# Altium project AE170_PDU_02.04.PrjPcb
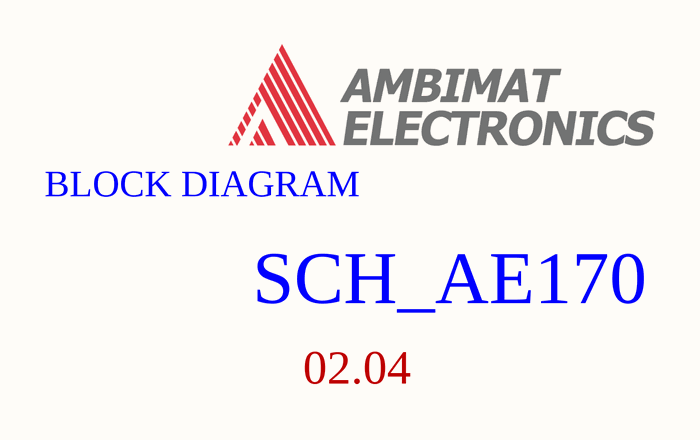
[diagram p0: 1. BD.SchDoc]
6 sheets, 141 parts. Net scope: global (net labels, ports and power ports of the same name join across sheets).
Board file: AE170_PDU_02.04.PcbDoc
Sheets:
  1. BD.SchDoc
  2. Input Section.SchDoc
  3. Buck Boost_19V.SchDoc
  4. Buck Boost_12V.SchDoc
  5. Buck_5V1A.SchDoc
  6. Revision History.SchDoc

## Sheet 1. BD.SchDoc
size A4; SheetNumber: 1; SheetTotal: 6

### Notes on the sheet
- BLOCK DIAGRAM
- SCH_AE170
- 02.04
- TITLE:
- Design By:
- NOTE: THIS DRAWING AND CONTENTS ARE CONFIDENTIAL AND ARE NOT TO BE COPIED
- Document Number:
- Rev:
- Sheet:
- of

## Sheet 2. Input Section.SchDoc
size A4; SheetNumber: 2; SheetTotal: 6; PageSetup: Record=PageOptions|CenterHorizontal=True|CenterVertical=True|PrintScale=1.00|XCorrection=1.00|YCorrection=1.00|PrintKind=0|BorderSize=5000000|LeftOffset=0|BottomOffset=0|Orientation=2|PaperLength=1000|PaperWidth=1000|Scale=100|PaperSource=7|PrintQuality=-3|MediaType=1|DitherType=10|PrintScaleMode=1|PaperKind=A4|PaperIndex=9
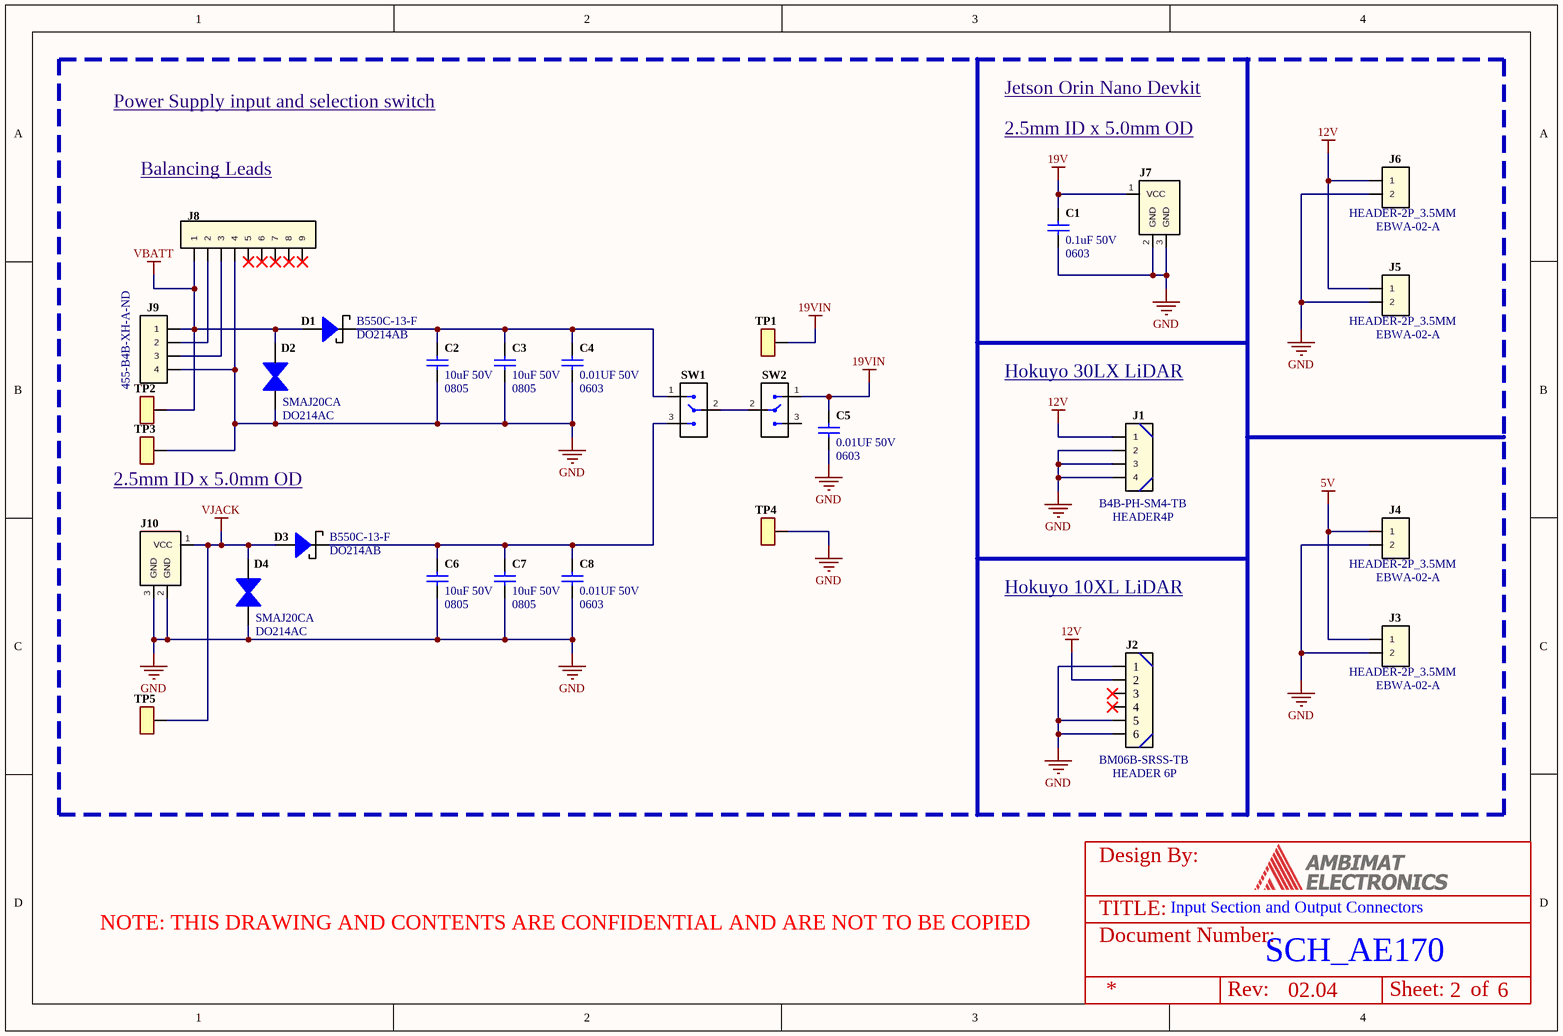
[diagram p1: 2. Input Section.SchDoc]

### Parts
C1  Part Name: 0.1uF 50V  PCB Footprint: 0603  [0603C]  (hidden comment: CAP CER 0.1UF 50V X7R 0603)
C2  Part Name: 10uF 50V  PCB Footprint: 0805  [0805C]  (hidden comment: CAP CER 10UF 50V X5R 0805)
C3  Part Name: 10uF 50V  PCB Footprint: 0805  [0805C]  (hidden comment: CAP CER 10UF 50V X5R 0805)
C4  Part Name: 0.01UF 50V  PCB Footprint: 0603  [0603C]  (hidden comment: CAP CER 10000PF 50V X7R 0603)
C5  Part Name: 0.01UF 50V  PCB Footprint: 0603  [0603C]  (hidden comment: CAP CER 10000PF 50V X7R 0603)
C6  Part Name: 10uF 50V  PCB Footprint: 0805  [0805C]  (hidden comment: CAP CER 10UF 50V X5R 0805)
C7  Part Name: 10uF 50V  PCB Footprint: 0805  [0805C]  (hidden comment: CAP CER 10UF 50V X5R 0805)
C8  Part Name: 0.01UF 50V  PCB Footprint: 0603  [0603C]  (hidden comment: CAP CER 10000PF 50V X7R 0603)
D1  PCB Footprint: DO214AB  Part Name: B550C-13-F  [DO-214AB-SHKY]  (hidden comment: DIODE SCHOTTKY 50V 5A SMC)
D2  PCB Footprint: DO214AC  Part Name: SMAJ20CA  [DO-214AC]  (hidden comment: TVS DIODE 20VWM 32.4VC DO214AC)
D3  PCB Footprint: DO214AB  Part Name: B550C-13-F  [DO-214AB-SHKY]  (hidden comment: DIODE SCHOTTKY 50V 5A SMC)
D4  PCB Footprint: DO214AC  Part Name: SMAJ20CA  [DO-214AC]  (hidden comment: TVS DIODE 20VWM 32.4VC DO214AC)
J1  Manu Part Number: B4B-PH-SM4-TB  Part Name: HEADER4P  [JST_B4B-PH-SM4-TB]  (hidden comment: CONN HEADER SMD 4POS 2MM)
J2  Manu Part Number: BM06B-SRSS-TB  PCB Footprint: HEADER 6P  [BM06B-SRSS-TB_JST]  (hidden comment: CONN HEADER SMD 6POS 1MM)
J3  Manu Part Number: EBWA-02-A  PCB Footprint: HEADER-2P_3.5MM  [Header3.5]  (hidden comment: EURO BLOCK 2P)
J4  Manu Part Number: EBWA-02-A  PCB Footprint: HEADER-2P_3.5MM  [Header3.5]  (hidden comment: EURO BLOCK 2P)
J5  Manu Part Number: EBWA-02-A  PCB Footprint: HEADER-2P_3.5MM  [Header3.5]  (hidden comment: EURO BLOCK 2P)
J6  Manu Part Number: EBWA-02-A  PCB Footprint: HEADER-2P_3.5MM  [Header3.5]  (hidden comment: EURO BLOCK 2P)
J7  CONN PWR JACK 2.5X5.5MM SOLDER  [PJ-050BH]  (value not drawn)
J8  HEADER 1x9  [HEADER-9P_2.54MM]  (value not drawn)
J9  Vendor-1 Part Number: 455-B4B-XH-A-ND  [JST_B4B-XH-A]  (hidden comment: CONN HEADER VERT 4POS 2.5MM)
J10  CONN PWR JACK 2.5X5.5MM SOLDER  [PJ-050BH]  (value not drawn)
SW1  SWITCH TOGGLE SPDT 7.5A 125V  [E101SYZQE]  (value not drawn)
SW2  SWITCH TOGGLE SPDT 7.5A 125V  [E101SYZQE]  (value not drawn)
TP1  TEST POINT  [TP-1.5mmSMD]  (value not drawn)
TP2  TEST POINT  [TP-1.5mmSMD]  (value not drawn)
TP3  TEST POINT  [TP-1.5mmSMD]  (value not drawn)
TP4  TEST POINT  [TP-1.5mmSMD]  (value not drawn)
TP5  TEST POINT  [TP-1.5mmSMD]  (value not drawn)

### Nets
5V: J3.1 J4.1
12V: J1.1 J2.2 J5.1 J6.1
19V: C1.2 J7.1(VCC)
19VIN: C5.1 SW2.1 TP1.1
GND: C1.1 C2.2 C3.2 C4.2 C5.2 C6.2 C7.2 C8.2 D2.1(A) D4.1(A) J1.2 J1.3 J1.4 J2.1 J2.5 J2.6 J3.2 J4.2 J5.2 J6.2 J7.2(GND) J7.3(GND) J8.4 J9.4 J10.2(GND) J10.3(GND) TP3.1 TP4.1
VBATT: D1.2 D2.2(K) J8.1 J9.1 TP2.1
VJACK: D3.2 D4.2(K) J10.1(VCC) TP5.1
NetC2_1: C2.1 C3.1 C4.1 D1.1 SW1.1
NetC6_1: C6.1 C7.1 C8.1 D3.1 SW1.3
NetJ8_2: J8.2 J9.2
NetJ8_3: J8.3 J9.3
NetSW1_2: SW1.2 SW2.2

Not connected (* = marked no-connect by the designer): J2 3* 4*; J8 5* 6* 7* 8* 9*; SW2 3

### Notes on the sheet
- Power Supply input and selection switch
- Jetson Orin Nano Devkit
- Balancing Leads
- 2.5mm ID x 5.0mm OD
- Hokuyo 30LX LiDAR
- (near TP3) 2.5mm ID x 5.0mm OD
- Hokuyo 10XL LiDAR
- Input Section and Output Connectors
- SCH_AE170
- 02.04
- TITLE:
- Design By:
- NOTE: THIS DRAWING AND CONTENTS ARE CONFIDENTIAL AND ARE NOT TO BE COPIED
- Document Number:
- Rev:
- Sheet:
- of

### Library data of the parts
C1 = CS0.1uF-50V0603: Manu Part Number: CC0603KRX7R9BB104; Manufacturer: Yageo; Vendor-1 Part Number: 311-1344-1-ND; Type: SMD; Vendor-1: DIGIKEY; Vendor-2: MOUSER; Lead Free: YES; Mounting: YES; RoHS Compliant: YES
C2 C3 C6 C7 = CS10uF-50V0805: Manu Part Number: GRM21BR61H106KE43L; Manufacturer: Murata Electronics; Vendor-1 Part Number: 490-18663-1-ND; Type: SMD; Vendor-1: DIGIKEY; Vendor-2: FARNELL; Help URL: *; Lead Free: YES; Mounting: YES; RoHS Compliant: YES
C4 C5 C8 = CS0.01uF-50V0603: Manu Part Number: CC0603KPX7R9BB103; Manufacturer: Yageo; Vendor-1 Part Number: 311-1572-1-ND; Type: SMD; Vendor-1: DIGIKEY; Vendor-2: FARNELL; Lead Free: YES; Mounting: YES; RoHS Compliant: YES
D1 D3 = DS-B550C-13-F: Manufacturer: Diodes Incorporated; Vendor-1 Part Number: B550C-FDICT-ND; Type: SMD; Vendor-1: DIGI-KEY; Vendor-2: MOUSER; Help URL: *; Lead Free: YES; Mounting: YES; Manu Part Number: B550C-13-F
D2 D4 = DS-SMAJ20CA: Manufacturer: Littelfuse Inc.; Vendor-1 Part Number: SMAJ20CALFCT-ND; Type: SMD; Vendor-1: DIGI-KEY; Vendor-2: MOUSER; Help URL: *; Lead Free: YES; Mounting: YES; Manu Part Number: SMAJ20CA
J1 = CON2.0P-4x1SMT: Manufacturer: JST Sales America Inc.; Vendor-1 Part Number: 455-B4B-PH-SM4-TBCT-ND; PCB Footprint: HEADER-4P_2.0MM; Vendor-1: DIGIKEY; Vendor-2: FARNELL; Mounting: YES; RoHS Compliant: YES; Type: SMT; Lead Free: YES
J2 = CON1.0P-6x1 SMT: Manufacturer: JST Sales America Inc.; Vendor-1 Part Number: 455-BM06B-SRSS-TBCT-ND; Vendor-1: DIGIKEY; Vendor-2: FARNELL; Mounting: YES; Part Name: BM06B-SRSS-TB; RoHS Compliant: YES; Type: SMD; Lead Free: YES
J3-J6 = CON3.5P-2x1TH_STRT: Manufacturer: Adam Tech; Part Name: HEADER2P; Vendor-1 Part Number: 2057-EBWA-02-A-ND; Vendor-1: DIGIKEY; Vendor-2: FARNELL; Mounting: YES; RoHS Compliant: YES; Type: TH; Lead Free: YES
J7 J10 = CON3P-PJ-050BH: Manufacturer: CUI Inc; Vendor-1 Part Number: CP-050BH-ND; PCB Footprint: TH 3P; Vendor-1: DIGIKEY; Vendor-2: FARNELL; Lead Free: YES; Mounting: YES; Type: TH; Manu Part Number: PJ-050BH; Part Name: PJ-050BH; PCB Footprint: JACK; RoHS Compliant: YES
J8 = CON2.54P-1x9: CONN HEADER 9PS 2.54MM; Part Name: 2.54MM HEADER; PCB Footprint: 1x9 2.54MM HEADER; Vendor-1: DIGIKEY; Mounting: YES; RoHS Compliant: YES; Type: TH; Lead Free: YES
J9 = CON2.5P-4x1TH: Manu Part Number: B4B-XH-A; Manufacturer: JST Sales America Inc.; Part Name: HEADER4P; PCB Footprint: HEADER-4P_2.5MM; Vendor-1: DIGIKEY; Vendor-2: FARNELL; Mounting: YES; RoHS Compliant: YES; Type: TH; Lead Free: YES
SW1 SW2 = SW-E101SYZQE: Manufacturer: C&K; Vendor-1 Part Number: CKN1519-ND; Vendor-1: DIGI-KEY; Vendor-2: MOUSER; Lead Free: YES; Mounting: YES; RoHS Compliant: YES; Manu Part Number: E101SYZQE; Part Name: E101SYZQE; PCB Footprint: E101SYZQE; Type: TH
TP1-TP5 = TP-1.5mmSMD: SMD TEST POINT

## Sheet 3. Buck Boost_19V.SchDoc
size A4; SheetNumber: 3; SheetTotal: 6; PageSetup: Record=PageOptions|CenterHorizontal=True|CenterVertical=True|PrintScale=1.00|XCorrection=1.00|YCorrection=1.00|PrintKind=0|BorderSize=5000000|LeftOffset=0|BottomOffset=0|Orientation=2|PaperLength=2970|PaperWidth=2100|Scale=100|PaperSource=7|PrintQuality=-3|MediaType=1|DitherType=10|PrintScaleMode=1|PaperKind=A4|PaperIndex=9
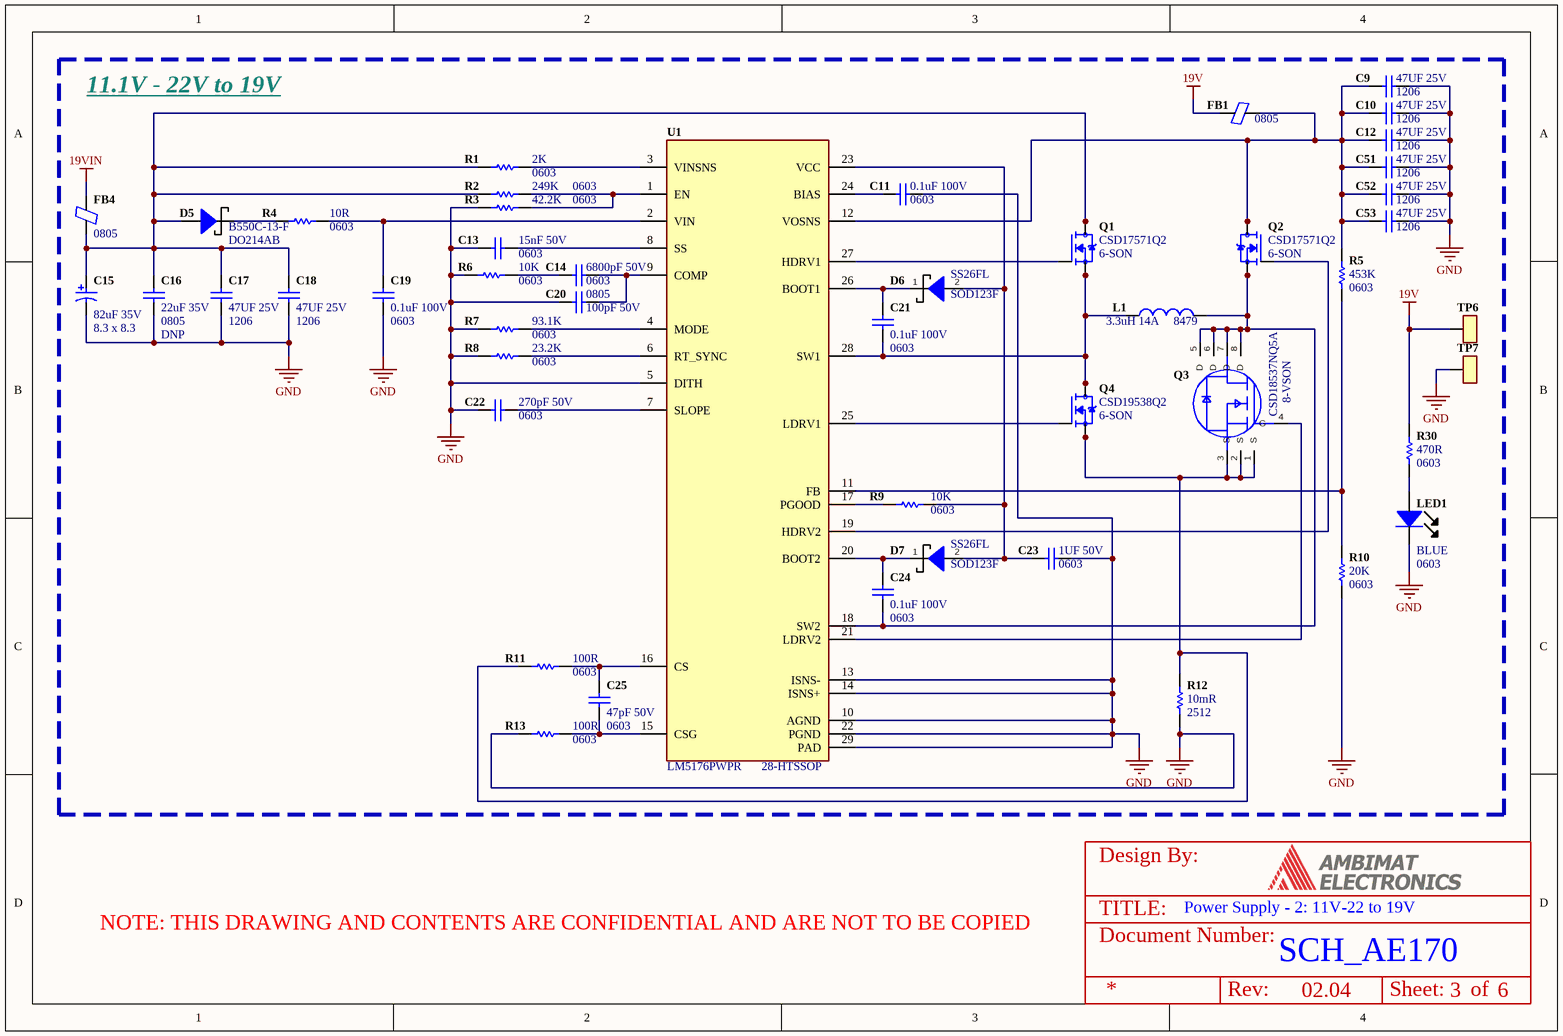
[diagram p2: 3. Buck Boost_19V.SchDoc]

### Parts
C9  Part Name: 47UF 25V  PCB Footprint: 1206  [1206 - NP]  (hidden comment: CAP CER 47UF 25V X5R 1206)
C10  Part Name: 47UF 25V  PCB Footprint: 1206  [1206 - NP]  (hidden comment: CAP CER 47UF 25V X5R 1206)
C11  Part Name: 0.1uF 100V  PCB Footprint: 0603  [0603C]  (hidden comment: CAP CER 0.1UF 100V X7R 0603)
C12  Part Name: 47UF 25V  PCB Footprint: 1206  [1206 - NP]  (hidden comment: CAP CER 47UF 25V X5R 1206)
C13  Part Name: 15nF 50V  PCB Footprint: 0603  [0603C]  (hidden comment: CAP CER 0.015UF 50V X7R 0603)
C14  Part Name: 6800pF 50V  PCB Footprint: 0603  [0603C]  (hidden comment: CAP CER 6800PF 50V X7R 0603)
C15  Part Name: 82uF 35V  PCB Footprint: 8.3 x 8.3  [CAP_PC_8X12_NCH]  (hidden comment: CAP ALUM POLY 82UF 20% 35V SMD)
C16  Mounting: DNP  Part Name: 22uF 35V  PCB Footprint: 0805  [0805C]  (hidden comment: CAP CER 22UF 35V X5R 0805)
C17  Part Name: 47UF 25V  PCB Footprint: 1206  [1206 - NP]  (hidden comment: CAP CER 47UF 25V X5R 1206)
C18  Part Name: 47UF 25V  PCB Footprint: 1206  [1206 - NP]  (hidden comment: CAP CER 47UF 25V X5R 1206)
C19  Part Name: 0.1uF 100V  PCB Footprint: 0603  [0603C]  (hidden comment: CAP CER 0.1UF 100V X7R 0603)
C20  Part Name: 100pF 50V  PCB Footprint: 0805  [0805C]  (hidden comment: CAP CER 100PF 50V C0G/NP0 0805)
C21  Part Name: 0.1uF 100V  PCB Footprint: 0603  [0603C]  (hidden comment: CAP CER 0.1UF 100V X7R 0603)
C22  Part Name: 270pF 50V  PCB Footprint: 0603  [0603C]  (hidden comment: CAP CER 270PF 50V X7R 0603)
C23  Part Name: 1UF 50V  PCB Footprint: 0603  [0603C]  (hidden comment: CAP CER 1UF 50V X7R 0603)
C24  Part Name: 0.1uF 100V  PCB Footprint: 0603  [0603C]  (hidden comment: CAP CER 0.1UF 100V X7R 0603)
C25  Part Name: 47pF 50V  PCB Footprint: 0603  [0603C]  (hidden comment: CAP CER 47PF 50V X7R 10% 0603)
C51  Part Name: 47UF 25V  PCB Footprint: 1206  [1206 - NP]  (hidden comment: CAP CER 47UF 25V X5R 1206)
C52  Part Name: 47UF 25V  PCB Footprint: 1206  [1206 - NP]  (hidden comment: CAP CER 47UF 25V X5R 1206)
C53  Part Name: 47UF 25V  PCB Footprint: 1206  [1206 - NP]  (hidden comment: CAP CER 47UF 25V X5R 1206)
D5  PCB Footprint: DO214AB  Part Name: B550C-13-F  [DO-214AB-SHKY]  (hidden comment: DIODE SCHOTTKY 50V 5A SMC)
D6  PCB Footprint: SOD123F  Part Name: SS26FL  [SOD123F-SHKY]  (hidden comment: DIODE SCHOTTKY 60V 2A SOD123F)
D7  PCB Footprint: SOD123F  Part Name: SS26FL  [SOD123F-SHKY]  (hidden comment: DIODE SCHOTTKY 60V 2A SOD123F)
FB1  PCB Footprint: 0805  [0805F]  (hidden comment: FERRITE BEAD 120 OHM 0805 1LN)
FB4  PCB Footprint: 0805  [0805F]  (hidden comment: FERRITE BEAD 120 OHM 0805 1LN)
L1  Part Name: 3.3uH 14A  PCB Footprint: 8479  [IND_8070-WE]  (hidden comment: FIXED IND 3.3UH 14A 8.2 MOHM SMD)
LED1  PCB Footprint: 0603  Color: BLUE  [LED0603_BLUE]  (hidden comment: LB Q39G-L2N2-35-1)
Q1  PCB Footprint: 6-SON  [CSD17571Q2]  (hidden comment: MOSFET N-CH 30V 22A 6SON)
Q2  PCB Footprint: 6-SON  [CSD17571Q2]  (hidden comment: MOSFET N-CH 30V 22A 6SON)
Q3  PCB Footprint: 8-VSON  Part Name: CSD18537NQ5A  [SON127P500X600]  (hidden comment: MOSFET N-CH 60V 50A 8VSON)
Q4  PCB Footprint: 6-SON  Part Name: CSD19538Q2  [CSD17571Q2]  (hidden comment: MOSFET N-CH 100V 14.4A 6WSON)
R1  Part Name: 2K  [0603]  (hidden comment: RS2K-0.1W0603)
R2  Part Name: 249K  [0603]  (hidden comment: RES SMD 249K OHM 1% 1/10W 0603)
R3  Part Name: 42.2K  [0603]  (hidden comment: RES 42.2K OHM 1% 1/10W 0603)
R4  Part Name: 10R  [0603]  (hidden comment: RES SMD 10 OHM 1% 1/10W 0603)
R5  Part Name: 453K  [0603]  (hidden comment: RES 453K OHM 1% 1/10W 0603)
R6  Part Name: 10K  [0603]  (hidden comment: RES SMD 10K OHM 5% 1/10W 0603)
R7  Part Name: 93.1K  [0603]  (hidden comment: RES 93.1K OHM 1% 1/10W 0603)
R8  Part Name: 23.2K  [0603]  (hidden comment: RES 23.2K OHM 1% 1/10W 0603)
R9  Part Name: 10K  [0603]  (hidden comment: RES SMD 10K OHM 5% 1/10W 0603)
R10  Part Name: 20K  [0603]  (hidden comment: RES SMD 20K OHM 5% 1/10W 0603)
R11  Part Name: 100R  [0603]  (hidden comment: RES SMD 100 OHM 1% 1/10W 0603)
R12  Part Name: 10mR  PCB Footprint: 2512  [R2512]  (hidden comment: RES 0.01 OHM 1% 3W 2512)
R13  Part Name: 100R  [0603]  (hidden comment: RES SMD 100 OHM 1% 1/10W 0603)
R30  Part Name: 470R  [0603]  (hidden comment: RES 470 OHM 1/10W 5% 0603 SMD)
TP6  TEST POINT  [TP-1.5mmSMD]  (value not drawn)
TP7  TEST POINT  [TP-1.5mmSMD]  (value not drawn)
U1  PCB Footprint: 28-HTSSOP  [HSSOP-28]  (hidden comment: LM5176PWPR)

### Blocks framed on the sheet
11.1V - 22V to 19V: C9-C25 C51-C53 D5-D7 FB1 FB4 L1 LED1 Q1-Q4 R1-R13 R30 TP6 TP7 U1

### Nets
19V: FB1.1 R30.2 TP6.1
19VIN: FB4.1
GND: C9.2 C10.2 C11.2 C12.2 C13.1 C15.2 C16.2 C17.1 C18.1 C19.2 C20.1 C22.1 C23.2 C51.2 C52.2 C53.2 LED1.2(K) R3.1 R6.1 R7.1 R8.1 R10.1 R12.1 R13.1 TP7.1 U1.5(DITH) U1.10(AGND) U1.13(ISNS-) U1.14(ISNS+) U1.22(PGND) U1.29(PAD)
NetC9_1: C9.1 C10.1 C12.1 C51.1 C52.1 C53.1 FB1.2 Q2.1(D) Q2.2(D) Q2.5(D) Q2.6(D) Q2.7(D) R5.2 U1.12(VOSNS)
NetC11_1: C11.1 U1.24(BIAS)
NetC13_2: C13.2 U1.8(SS)
NetC14_1: C14.1 R6.2
NetC14_2: C14.2 C20.2 U1.9(COMP)
NetC15_1: C15.1 C16.1 C17.2 C18.2 D5.2 FB4.2 Q1.1(D) Q1.2(D) Q1.5(D) Q1.6(D) Q1.7(D) R1.1 R2.1
NetC19_1: C19.1 R4.2 U1.2(VIN)
NetC21_1: C21.1 L1.1 Q1.4(S) Q1.8(S) Q4.1(D) Q4.2(D) Q4.5(D) Q4.6(D) Q4.7(D) U1.28(SW1)
NetC21_2: C21.2 D6.1 U1.26(BOOT1)
NetC22_2: C22.2 U1.7(SLOPE)
NetC23_1: C23.1 D6.2 D7.2 R9.2 U1.23(VCC)
NetC24_1: C24.1 L1.2 Q2.4(S) Q2.8(S) Q3.5(D) Q3.6(D) Q3.7(D) Q3.8(D) U1.18(SW2)
NetC24_2: C24.2 D7.1 U1.20(BOOT2)
NetC25_1: C25.1 R11.2 U1.16(CS)
NetC25_2: C25.2 R13.2 U1.15(CSG)
NetD5_1: D5.1 R4.1
NetLED1_1: LED1.1(A) R30.1
NetQ1_3: Q1.3(G) U1.27(HDRV1)
NetQ2_3: Q2.3(G) U1.19(HDRV2)
NetQ3_1: Q3.1(S) Q3.2(S) Q3.3(S) Q4.4(S) Q4.8(S) R11.1 R12.2
NetQ3_4: Q3.4(G) U1.21(LDRV2)
NetQ4_3: Q4.3(G) U1.25(LDRV1)
NetR1_2: R1.2 U1.3(VINSNS)
NetR2_2: R2.2 R3.2 U1.1(EN)
NetR5_1: R5.1 R10.2 U1.11(FB)
NetR7_2: R7.2 U1.4(MODE)
NetR8_2: R8.2 U1.6(RT_SYNC)
NetR9_1: R9.1 U1.17(PGOOD)

### Notes on the sheet
- Power Supply - 2: 11V-22 to 19V
- SCH_AE170
- 02.04
- TITLE:
- Design By:
- NOTE: THIS DRAWING AND CONTENTS ARE CONFIDENTIAL AND ARE NOT TO BE COPIED
- Document Number:
- Rev:
- Sheet:
- of

### Library data of the parts
C9 C10 C12 C17 C18 C51-C53 = CS47UF-25V1206: Manufacturer Part Number: C3216X5R1E476M160AC; Manufacturer: TDK Corporation; Vendor-1 Part Number: 445-8047-1-ND; Type: SMD; Vendor-1: DIGIKEY; Vendor-2: FARNELL; Lead Free: YES; Mounting: YES; RoHS Compliant: YES
C11 C19 C21 C24 = CS0.1uF-100V0603: Manu Part Number: CC0603KRX7R0BB104; Manufacturer: YAGEO; Vendor-1 Part Number: 311-1523-1-ND; Type: SMD; Vendor-1: DIGIKEY; Vendor-2: MOUSER; Lead Free: YES; Mounting: YES; RoHS Compliant: YES
C13 = CS15nF-50V0603: Manufacturer Part Number: CL10B153KB8NNNC; Manufacturer: Samsung Electro-Mechanics; Vendor-1 Part Number: 1276-1277-1-ND; Type: SMD; Vendor-1: DIGIKEY; Vendor-2: FARNELL; Lead Free: YES; Mounting: YES; RoHS Compliant: YES
C14 = CS6800pF-50V0603: Manufacturer: YAGEO; Vendor-1 Part Number: 13-AC0603KPX7R9BB682CT-ND; Manufacturer Part Number: AC0603KPX7R9BB682; Type: SMD; Vendor-1: DIgikey; Vendor-2: Element14; Lead Free: YES; Mounting: YES; Rohs Complinat: YES
C15 = CS82uF-35VALUM: Manu Part Number: 35SVPF82M; Manufacturer: Panasonic; Vendor-1 Part Number: P16562CT-ND; Vendor-1: DIGIKEY; Vendor-2: FARNELL; Help URL: *; Lead Free: YES; Mounting: YES; RoHS Compliant: YES; Type: SMD
C16 = CS22uF-35V0805: Manu Part Number: C2012X5R1V226M125AC; Manufacturer: TDK Corporation; Vendor-1 Part Number: 445-14428-1-ND; Type: SMD; Vendor-1: DIGIKEY; Vendor-2: FARNELL; Help URL: *; Lead Free: YES; RoHS Compliant: YES
C20 = CS100pF-50V0805: Manufacturer: AVX Corporation; Vendor-1 Part Number: 478-1316-1-ND; Manu Part Number: 08055A101JAT2A; Type: SMD; Vendor-1: DIGIKEY; Vendor-2: FARNELL; Lead Free: YES; Mounting: YES; Vendor-2 Part Number: *; HELP URL: https://www.digikey.in/products/en?keywords=478-1316-1-ND; RoHS Compliant: YES
C22 = CS270pF-50V0603: Manufacturer Part Number: CC0603KRX7R9BB271; Manufacturer: Yageo; Vendor-1 Part Number: 311-1185-1-ND; Type: SMD; Vendor-1: DIgikey; Vendor-2: Element14; Lead Free: YES; Rohs Complinat: YES; Mounting: YES
C23 = CS1uF-50V0603: Manu Part Number: CC0603KRX7R9BB105; Manufacturer: Yageo; Vendor-1 Part Number: 311-2082-1-ND; Type: SMD; Vendor-1: DIGIKEY; Vendor-2: FARNELL; Help URL: *; Lead Free: YES; Mounting: YES; RoHS Compliant: YES
C25 = CS47pF-50V0603: Manufacturer: KEMET; Vendor-1 Part Number: 399-16402-1-ND; Manufacturer Part Number: C0603C470K5RAC7867; Type: SMD; Vendor-1: DIGIKEY; Vendor-2: FARNELL; Lead Free: YES; Mounting: YES; RoHS Compliant: YES
D5 = DS-B550C-13-F: as D1 on sheet 2. Input Section; Help URL: *; Lead Free: YES; Mounting: YES; Manu Part Number: B550C-13-F
D6 D7 = DS-SS26FL: Manufacturer: onsemi; Vendor-1 Part Number: SS26FLCT-ND; Type: SMD; Vendor-1: DIGI-KEY; Vendor-2: MOUSER; Help URL: *; Lead Free: YES; Mounting: YES; Manu Part Number: SS26FL
FB1 FB4 = FB120OHM-0805: Manufacturer: Pulse Electronics; Manufacturer Part Number: ABUP00201209121Y00; Vendor-1 Part Number: 553-ABUP00201209121Y00CT-ND; Vendor-1: Digikey; Type: SMD; Lead Free: YES; RoHS Compliant: YES; Vendor-2 Part Number: *; Vendor-2: *; Mounting: YES; Part Name: ABUP00201209121Y00
L1 = LS3.3uH14A-8479: Manufacturer Part Number: 7443340330; Manufacturer: Würth Elektronik; Vendor-1 Part Number: 732-2165-1-ND; Vendor-1: Digikey; Lead Free: YES; Type: SMD; RoHS Compliant: YES; Vendor-2 Part Number: *; Vendor-2: *; Mounting: YES
LED1 = LED-BLUE0603: LED BLUE CLEAR 3MM 470NM; Manufacturer: OSRAM Opto Semiconductors Inc; Vendor-1 Part Number: 475-2816-1-ND; Vendor-2 Part Number: 1652110; Type: SMD; Vendor-1: DIGIKEY; Vendor-2: FARNELL; Help URL: *; Lead Free: YES; Manu Part Number: LB Q39G-L2N2-35-1; Mounting: YES; RoHS Compliant: YES; Part Name: LB Q39G-L2N2-35-1
Q1 Q2 = MS-CSD17571Q2: Manufacturer: Texas Instruments; Vendor-1 Part Number: 296-37193-1-ND; Type: SMD; Vendor-1: DIGIKEY; Lead Free: YES; Manu Part Number: CSD17571Q2; Mounting: YES; RoHS Compliant: YES; Part Name: CSD17571Q2
Q3 = MS-CSD18537NQ5A: Manufacturer: Texas Instruments; Vendor-1 Part Number: 296-36455-1-ND; Type: TH; Vendor-1: DIGIKEY; Lead Free: YES; Manu Part Number: CSD18537NQ5A; Mounting: YES; RoHS Compliant: YES
Q4 = MS-CSD19538Q2: Manufacturer: Texas Instruments; Vendor-1 Part Number: 296-37193-1-ND; Type: SMD; Vendor-1: DIGIKEY; Lead Free: YES; Manu Part Number: CSD19538Q2; Mounting: YES; RoHS Compliant: YES
R1 = RS2K-0.1W0603: RES SMD 2K OHM 5% 1/10W 0603; Manu Part Number: ERJ-3GEYJ202V; Manufacturer: Panasonic; Vendor-1 Part Number: P2.0KGCT-ND; Vendor-1: DIGIKEY; Vendor-2: FARNELL; Lead Free: YES; Mounting: YES; RoHS Compliant: YES; Type: SMD; PCB Footprint: 0603
R2 = RS249K-0.1W0603: Manufacturer Part Number: AC0603FR-07249KL; Manufacturer: Yageo; Vendor-1 Part Number: 13-AC0603FR-07249KLCT-ND; Vendor-1: DIGIKEY; Vendor-2: FARNELL; Lead Free: YES; Mounting: YES; RoHS Compliant: YES; Type: SMD; PCB Footprint: 0603
R3 = RS42.2K-0.1W0603: Manufacturer Part Number: RC0603FR-0742K2L; Manufacturer: Yageo; Vendor-1 Part Number: 311-42.2KHRCT-ND; Vendor-1: DIGIKEY; Vendor-2: FARNELL; Lead Free: YES; Mounting: YES; RoHS Compliant: YES; Type: SMD; PCB Footprint: 0603
R4 = RS10R-0.1W0603: Manu Part Number: CRCW060310R0FKEA; Manufacturer: Vishay Dale; Vendor-1 Part Number: 541-10.0HCT-ND; Vendor-1: DIGIKEY; Vendor-2: FARNELL; Lead Free: YES; Mounting: YES; RoHS Compliant: YES; Type: SMD; PCB Footprint: 0603
R5 = RS453K-0.1W0603: Manu Part Number: RC0603FR-07453KL; Manufacturer: Yageo; Vendor-1 Part Number: 311-453KHRCT-ND; Vendor-1: DIGIKEY; Vendor-2: FARNELL; Lead Free: YES; Mounting: YES; RoHS Compliant: YES; Type: SMD; PCB Footprint: 0603
R6 = RS10K-0.1W0603: Manufacturer Part Number: RC0603JR-0710KL; Manufacturer: Yageo; Vendor-1 Part Number: 311-10KGRCT-ND; Vendor-1: DIGIKEY; Vendor-2: FARNELL; Lead Free: YES; Mounting: YES; Help URL: https://www.digikey.com/product-detail/en/yageo/RC0603JR-0710KL/311-10KGRCT-ND/729647; RoHS Compliant: YES; Type: SMD; PCB Footprint: 0603
R7 = RS93.1K-0.1W0603: Manu Part Number: RC0603FR-0793K1L; Manufacturer: YAGEO; Vendor-1 Part Number: 311-93.1KHRCT-ND; Vendor-1: DIGIKEY; Vendor-2: FARNELL; Lead Free: YES; Mounting: YES; RoHS Compliant: YES; Type: SMD; PCB Footprint: 0603
R8 = RS23.2K-0.1W0603: Manu Part Number: RC0603FR-0723K2L; Manufacturer: YAGEO; Vendor-1 Part Number: 311-23.2KHRCT-ND; Vendor-1: DIGIKEY; Vendor-2: FARNELL; Lead Free: YES; Mounting: YES; RoHS Compliant: YES; Type: SMD; PCB Footprint: 0603
R9 = RS10K-0.1W0603: Manufacturer: Yageo; Vendor-1 Part Number: 311-10KGRCT-ND; Manufacturer Part Number: RC0603JR-0710KL; Vendor-1: DIGIKEY; Vendor-2: FARNELL; Lead Free: YES; Mounting: YES; RoHS Compliant: YES; Type: SMD; PCB Footprint: 0603; Help URL: https://www.digikey.com/product-detail/en/yageo/RC0603JR-0710KL/311-10KGRCT-ND/729647
R10 = RS20K-0.1W0603: Manu Part Number: CRCW060320K0JNEA; Manufacturer: Vishay Dale; Vendor-1 Part Number: 541-20KGCT-ND; Vendor-1: DIGIKEY; Vendor-2: FARNELL; Lead Free: YES; Mounting: YES; RoHS Compliant: YES; Type: SMD; Help URL: *; PCB Footprint: 0603
R11 R13 = RS100R-0.1W0603: Manu Part Number: CRCW0603100RFKEA; Manufacturer: Vishay Dale; Vendor-1 Part Number: 541-100HCT-ND; Vendor-1: DIGIKEY; Vendor-2: FARNELL; Lead Free: YES; Mounting: YES; RoHS Compliant: YES; Type: SMD; PCB Footprint: 0603
R12 = RS10mR-3W2512: Manu Part Number: PA2512FKE7T0R01E; Manufacturer: YAGEO; Vendor-1 Part Number: 13-PA2512FKE7T0R01ECT-ND; Vendor-1: DIGIKEY; Vendor-2: FARNELL; Lead Free: YES; Mounting: YES; RoHS Compliant: YES; Type: SMD
R30 = RS470R-1/10W0603: Manu Part Number: RC0603JR-07470RL; Manufacturer: YAGEO; Vendor-1 Part Number: 311-470GRCT-ND; Vendor-1: DIGIKEY; Vendor-2: MOUSER; Lead Free: YES; Mounting: YES; RoHS Compliant: YES; Type: SMD; PCB Footprint: 0603
TP6 TP7 = TP-1.5mmSMD: SMD TEST POINT
U1 = IC28P-LM5176PWPR: Manufacturer: Texas Instruments; Vendor-1 Part Number: 296-49223-1-ND; Vendor-1: DigiKey; Vendor-2: Element14; Lead Free: YES; Mounting: YES; RoHS Compliant: YES; Type: SMD; Manufacturer Part Numbe: LM5176PWPR

## Sheet 4. Buck Boost_12V.SchDoc
size A4; SheetNumber: 4; SheetTotal: 6
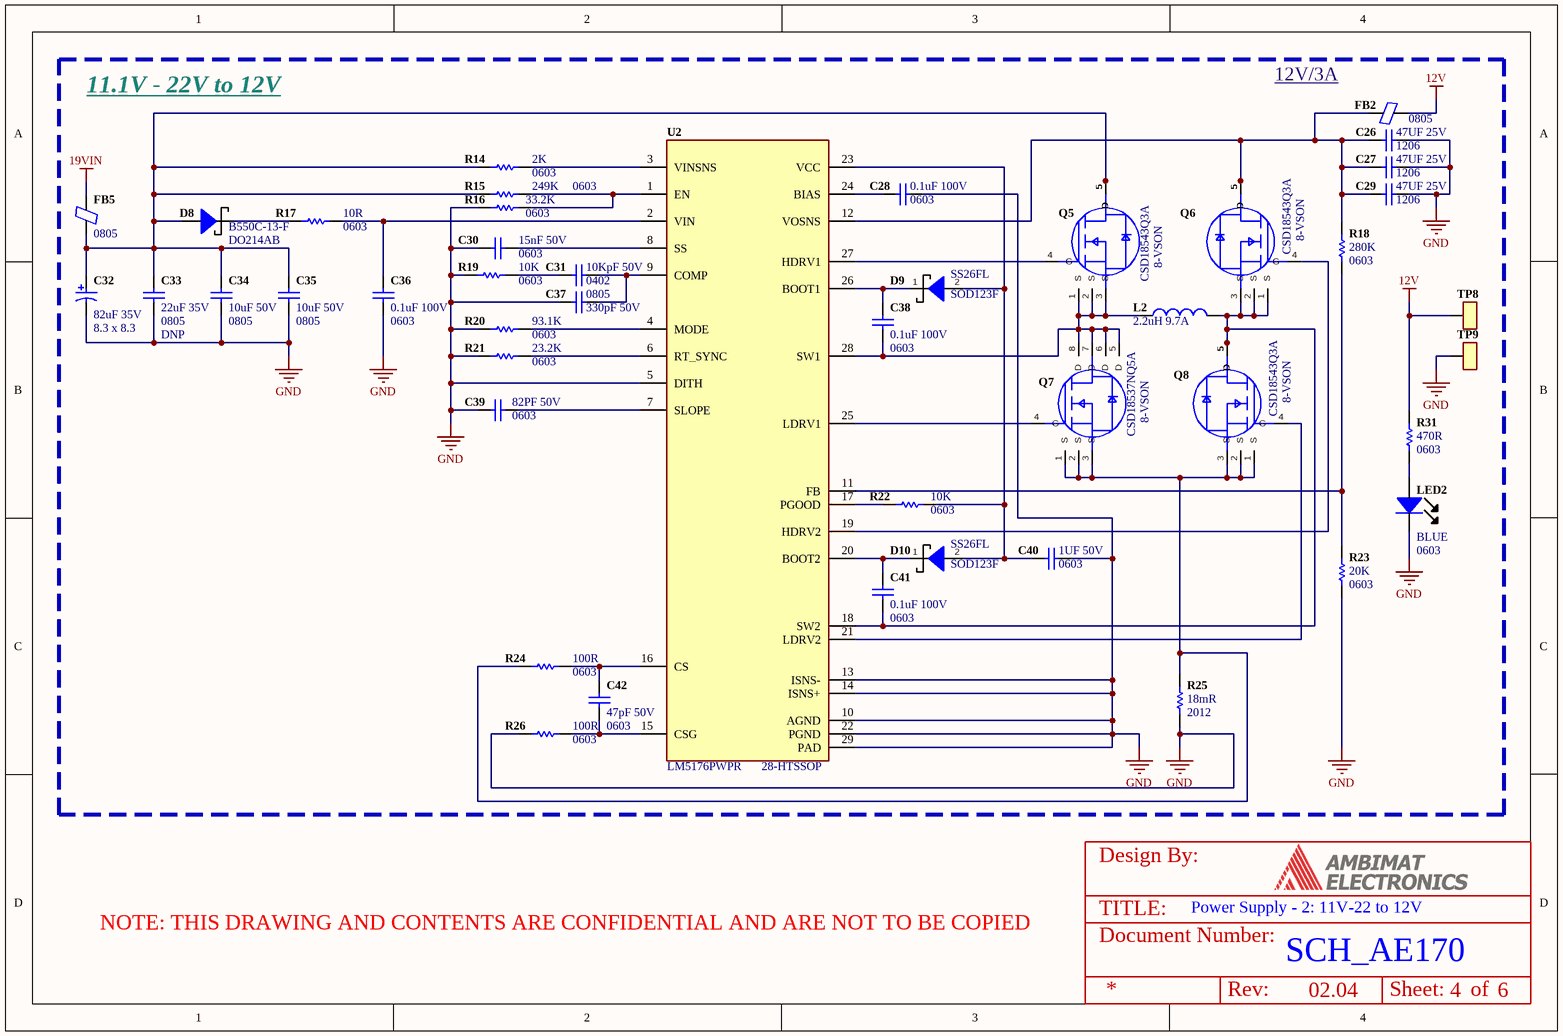
[diagram p3: 4. Buck Boost_12V.SchDoc]

### Parts
C26  Part Name: 47UF 25V  PCB Footprint: 1206  [1206 - NP]  (hidden comment: CAP CER 47UF 25V X5R 1206)
C27  Part Name: 47UF 25V  PCB Footprint: 1206  [1206 - NP]  (hidden comment: CAP CER 47UF 25V X5R 1206)
C28  Part Name: 0.1uF 100V  PCB Footprint: 0603  [0603C]  (hidden comment: CAP CER 0.1UF 100V X7R 0603)
C29  Part Name: 47UF 25V  PCB Footprint: 1206  [1206 - NP]  (hidden comment: CAP CER 47UF 25V X5R 1206)
C30  Part Name: 15nF 50V  PCB Footprint: 0603  [0603C]  (hidden comment: CAP CER 0.015UF 50V X7R 0603)
C31  Part Name: 10KpF 50V  PCB Footprint: 0402  [0402C]  (hidden comment: CAP CER 10000PF 50V X7R 0402)
C32  Part Name: 82uF 35V  PCB Footprint: 8.3 x 8.3  [CAP_PC_8X12_NCH]  (hidden comment: CAP ALUM POLY 82UF 20% 35V SMD)
C33  Mounting: DNP  Part Name: 22uF 35V  PCB Footprint: 0805  [0805C]  (hidden comment: CAP CER 22UF 35V X5R 0805)
C34  Part Name: 10uF 50V  PCB Footprint: 0805  [0805C]  (hidden comment: CAP CER 10UF 50V X5R 0805)
C35  Part Name: 10uF 50V  PCB Footprint: 0805  [0805C]  (hidden comment: CAP CER 10UF 50V X5R 0805)
C36  Part Name: 0.1uF 100V  PCB Footprint: 0603  [0603C]  (hidden comment: CAP CER 0.1UF 100V X7R 0603)
C37  Part Name: 330pF 50V  PCB Footprint: 0805  [0805C]  (hidden comment: CAP CER 330PF 50V C0G/NPO 0805)
C38  Part Name: 0.1uF 100V  PCB Footprint: 0603  [0603C]  (hidden comment: CAP CER 0.1UF 100V X7R 0603)
C39  Part Name: 82PF 50V  PCB Footprint: 0603  [0603C]  (hidden comment: CAP CER 82PF 50V C0G/NPO 0603)
C40  Part Name: 1UF 50V  PCB Footprint: 0603  [0603C]  (hidden comment: CAP CER 1UF 50V X7R 0603)
C41  Part Name: 0.1uF 100V  PCB Footprint: 0603  [0603C]  (hidden comment: CAP CER 0.1UF 100V X7R 0603)
C42  Part Name: 47pF 50V  PCB Footprint: 0603  [0603C]  (hidden comment: CAP CER 47PF 50V X7R 10% 0603)
D8  PCB Footprint: DO214AB  Part Name: B550C-13-F  [DO-214AB-SHKY]  (hidden comment: DIODE SCHOTTKY 50V 5A SMC)
D9  PCB Footprint: SOD123F  Part Name: SS26FL  [SOD123F-SHKY]  (hidden comment: DIODE SCHOTTKY 60V 2A SOD123F)
D10  PCB Footprint: SOD123F  Part Name: SS26FL  [SOD123F-SHKY]  (hidden comment: DIODE SCHOTTKY 60V 2A SOD123F)
FB2  PCB Footprint: 0805  [0805F]  (hidden comment: FERRITE BEAD 120 OHM 0805 1LN)
FB5  PCB Footprint: 0805  [0805F]  (hidden comment: FERRITE BEAD 120 OHM 0805 1LN)
L2  Part Name: 2.2uH 9.7A  [IND_BOURNS_SRP5030]  (hidden comment: FIXED IND 2.2UH 9.7A 14.5MOHM SM)
LED2  PCB Footprint: 0603  Color: BLUE  [LED0603_BLUE]  (hidden comment: LB Q39G-L2N2-35-1)
Q5  PCB Footprint: 8-VSON  Part Name: CSD18543Q3A  [SON65P300X350X90-9N]  (hidden comment: MOSFET N-CH 60V 60A 8VSON)
Q6  PCB Footprint: 8-VSON  Part Name: CSD18543Q3A  [SON65P300X350X90-9N]  (hidden comment: MOSFET N-CH 60V 60A 8VSON)
Q7  PCB Footprint: 8-VSON  Part Name: CSD18537NQ5A  [SON127P500X600]  (hidden comment: MOSFET N-CH 60V 50A 8VSON)
Q8  PCB Footprint: 8-VSON  Part Name: CSD18543Q3A  [SON65P300X350X90-9N]  (hidden comment: MOSFET N-CH 60V 60A 8VSON)
R14  Part Name: 2K  [0603]  (hidden comment: RS2K-0.1W0603)
R15  Part Name: 249K  [0603]  (hidden comment: RES SMD 249K OHM 1% 1/10W 0603)
R16  Part Name: 33.2K  [0603]  (hidden comment: RES SMD 33.2K OHM 1% 1/10W 0603)
R17  Part Name: 10R  [0603]  (hidden comment: RES SMD 10 OHM 1% 1/10W 0603)
R18  Part Name: 280K  [0603]  (hidden comment: RES SMD 280K OHM 1% 1/10W 0603)
R19  Part Name: 10K  [0603]  (hidden comment: RES SMD 10K OHM 5% 1/10W 0603)
R20  Part Name: 93.1K  [0603]  (hidden comment: RES 93.1K OHM 1% 1/10W 0603)
R21  Part Name: 23.2K  [0603]  (hidden comment: RES 23.2K OHM 1% 1/10W 0603)
R22  Part Name: 10K  [0603]  (hidden comment: RES SMD 10K OHM 5% 1/10W 0603)
R23  Part Name: 20K  [0603]  (hidden comment: RES SMD 20K OHM 5% 1/10W 0603)
R24  Part Name: 100R  [0603]  (hidden comment: RES SMD 100 OHM 1% 1/10W 0603)
R25  Part Name: 18mR  PCB Footprint: 2012  [1206_W]  (hidden comment: RES 0.018 OHM 1W 1206 WIDE)
R26  Part Name: 100R  [0603]  (hidden comment: RES SMD 100 OHM 1% 1/10W 0603)
R31  Part Name: 470R  [0603]  (hidden comment: RES 470 OHM 1/10W 5% 0603 SMD)
TP8  TEST POINT  [TP-1.5mmSMD]  (value not drawn)
TP9  TEST POINT  [TP-1.5mmSMD]  (value not drawn)
U2  PCB Footprint: 28-HTSSOP  [HSSOP-28]  (hidden comment: LM5176PWPR)

### Nets
12V: FB2.2 R31.2 TP8.1
19VIN: FB5.1
GND: C26.2 C27.2 C28.2 C29.2 C30.1 C32.2 C33.2 C34.2 C35.2 C36.2 C37.1 C39.1 C40.2 LED2.2(K) R16.1 R19.1 R20.1 R21.1 R23.1 R25.1 R26.1 TP9.1 U2.5(DITH) U2.10(AGND) U2.13(ISNS-) U2.14(ISNS+) U2.22(PGND) U2.29(PAD)
NetC26_1: C26.1 C27.1 C29.1 FB2.1 Q6.5(D) R18.2 U2.12(VOSNS)
NetC28_1: C28.1 U2.24(BIAS)
NetC30_2: C30.2 U2.8(SS)
NetC31_1: C31.1 R19.2
NetC31_2: C31.2 C37.2 U2.9(COMP)
NetC32_1: C32.1 C33.1 C34.1 C35.1 D8.2 FB5.2 Q5.5(D) R14.1 R15.1
NetC36_1: C36.1 R17.2 U2.2(VIN)
NetC38_1: C38.1 L2.1 Q5.1(S) Q5.2(S) Q5.3(S) Q7.5(D) Q7.6(D) Q7.7(D) Q7.8(D) U2.28(SW1)
NetC38_2: C38.2 D9.1 U2.26(BOOT1)
NetC39_2: C39.2 U2.7(SLOPE)
NetC40_1: C40.1 D9.2 D10.2 R22.2 U2.23(VCC)
NetC41_1: C41.1 L2.2 Q6.1(S) Q6.2(S) Q6.3(S) Q8.5(D) U2.18(SW2)
NetC41_2: C41.2 D10.1 U2.20(BOOT2)
NetC42_1: C42.1 R24.2 U2.16(CS)
NetC42_2: C42.2 R26.2 U2.15(CSG)
NetD8_1: D8.1 R17.1
NetLED2_1: LED2.1(A) R31.1
NetQ5_4: Q5.4(G) U2.27(HDRV1)
NetQ6_4: Q6.4(G) U2.19(HDRV2)
NetQ7_1: Q7.1(S) Q7.2(S) Q7.3(S) Q8.1(S) Q8.2(S) Q8.3(S) R24.1 R25.2
NetQ7_4: Q7.4(G) U2.25(LDRV1)
NetQ8_4: Q8.4(G) U2.21(LDRV2)
NetR14_2: R14.2 U2.3(VINSNS)
NetR15_2: R15.2 R16.2 U2.1(EN)
NetR18_1: R18.1 R23.2 U2.11(FB)
NetR20_2: R20.2 U2.4(MODE)
NetR21_2: R21.2 U2.6(RT_SYNC)
NetR22_1: R22.1 U2.17(PGOOD)

### Notes on the sheet
- 11.1V - 22V to 12V
- 12V/3A
- Power Supply - 2: 11V-22 to 12V
- SCH_AE170
- 02.04
- TITLE:
- Design By:
- NOTE: THIS DRAWING AND CONTENTS ARE CONFIDENTIAL AND ARE NOT TO BE COPIED
- Document Number:
- Rev:
- Sheet:
- of

### Library data of the parts
C26 C27 C29 = CS47UF-25V1206: as C9 on sheet 3. Buck Boost_19V; Lead Free: YES; Mounting: YES; RoHS Compliant: YES
C28 C36 C38 C41 = CS0.1uF-100V0603: as C11 on sheet 3. Buck Boost_19V; Lead Free: YES; Mounting: YES; RoHS Compliant: YES
C30 = CS15nF-50V0603: as C13 on sheet 3. Buck Boost_19V; Lead Free: YES; Mounting: YES; RoHS Compliant: YES
C31 = CS10000pF-50V0402: Manufacturer: TDK Corporation; Vendor-1 Part Number: 445-6893-1-ND; Manufacturer Part Number: CGA2B3X7R1H103K050BB; Type: SMD; Vendor-1: DIGIKEY; Vendor-2: FARNELL; Lead Free: YES; Mounting: YES; RoHS Compliant: YES
C32 = CS82uF-35VALUM: as C15 on sheet 3. Buck Boost_19V; Help URL: *; Lead Free: YES; Mounting: YES; RoHS Compliant: YES; Type: SMD
C33 = CS22uF-35V0805: as C16 on sheet 3. Buck Boost_19V; Help URL: *; Lead Free: YES; RoHS Compliant: YES
C34 C35 = CS10uF-50V0805: as C2 on sheet 2. Input Section; Help URL: *; Lead Free: YES; Mounting: YES; RoHS Compliant: YES
C37 = CS330pF-50V0805: Manufacturer: YAGEO; Vendor-1 Part Number: 311-1117-1-ND; Manufacturer Part Number: CC0805JRNPO9BN331; Type: SMD; Vendor-1: DIgikey; Vendor-2: Element14; Lead Free: YES; Mounting: YES; Rohs Complinat: YES
C39 = CS82pF-50V0603: Manufacturer: Yageo; Vendor-1 Part Number: 311-1068-1-ND; Manu Part Number: CC0603JRNPO9BN820; Type: SMD; Vendor-1: DIGIKEY; Vendor-2: FARNELL; Lead Free: YES; Mounting: YES; RoHS Compliant: YES
C40 = CS1uF-50V0603: as C23 on sheet 3. Buck Boost_19V; Help URL: *; Lead Free: YES; Mounting: YES; RoHS Compliant: YES
C42 = CS47pF-50V0603: as C25 on sheet 3. Buck Boost_19V; Lead Free: YES; Mounting: YES; RoHS Compliant: YES
D8 = DS-B550C-13-F: as D1 on sheet 2. Input Section; Help URL: *; Lead Free: YES; Mounting: YES; Manu Part Number: B550C-13-F
D9 D10 = DS-SS26FL: as D6 on sheet 3. Buck Boost_19V; Help URL: *; Lead Free: YES; Mounting: YES; Manu Part Number: SS26FL
FB2 FB5 = FB120OHM-0805: as FB1 on sheet 3. Buck Boost_19V; Lead Free: YES; RoHS Compliant: YES; Vendor-2 Part Number: *; Vendor-2: *; Mounting: YES; Part Name: ABUP00201209121Y00
L2 = LS2.2uH9.7A-5553: Manufacturer Part Number: SRP5030CA-2R2M; Manufacturer: Bourns Inc.; Vendor-1 Part Number: SRP5030CA-2R2MCT-ND; Type: SMD; Vendor-1: Digikey; PCB Footprint: 5553; Lead Free: YES; RoHS Compliant: YES; Vendor-2 Part Number: *; Vendor-2: *; Mounting: YES
LED2 = LED-BLUE0603: as LED1 on sheet 3. Buck Boost_19V; Help URL: *; Lead Free: YES; Manu Part Number: LB Q39G-L2N2-35-1; Mounting: YES; RoHS Compliant: YES; Part Name: LB Q39G-L2N2-35-1
Q5 Q6 Q8 = MS-CSD18543Q3A: Manufacturer: Texas Instruments; Vendor-1 Part Number: 296-47321-1-ND; Type: TH; Vendor-1: DIGIKEY; Lead Free: YES; Manu Part Number: CSD18543Q3A; Mounting: YES; RoHS Compliant: YES
Q7 = MS-CSD18537NQ5A: as Q3 on sheet 3. Buck Boost_19V; Lead Free: YES; Manu Part Number: CSD18537NQ5A; Mounting: YES; RoHS Compliant: YES
R14 = RS2K-0.1W0603: as R1 on sheet 3. Buck Boost_19V; Lead Free: YES; Mounting: YES; RoHS Compliant: YES; Type: SMD; PCB Footprint: 0603
R15 = RS249K-0.1W0603: as R2 on sheet 3. Buck Boost_19V; Lead Free: YES; Mounting: YES; RoHS Compliant: YES; Type: SMD; PCB Footprint: 0603
R16 = RS33.2K-0.1W0603: Manufacturer: Panasonic Electronic Components; Vendor-1 Part Number: P33.2KHCT-ND; Manu Part Number: ERJ-3EKF3322V; Vendor-1: DIGIKEY; Vendor-2: FARNELL; Lead Free: YES; Mounting: YES; RoHS Compliant: YES; Type: SMD; PCB Footprint: 0603
R17 = RS10R-0.1W0603: as R4 on sheet 3. Buck Boost_19V; Lead Free: YES; Mounting: YES; RoHS Compliant: YES; Type: SMD; PCB Footprint: 0603
R18 = RS280K-0.1W0603: Manu Part Number: CRCW0603280KFKEA; Manufacturer: Vishay Dale; Vendor-1 Part Number: 541-280KHCT-ND; Vendor-1: DIGIKEY; Vendor-2: FARNELL; Help URL: *; Lead Free: YES; Mounting: YES; RoHS Compliant: YES; Type: SMD; PCB Footprint: 0603
R19 = RS10K-0.1W0603: as R6 on sheet 3. Buck Boost_19V; Lead Free: YES; Mounting: YES; Help URL: https://www.digikey.com/product-detail/en/yageo/RC0603JR-0710KL/311-10KGRCT-ND/729647; RoHS Compliant: YES; Type: SMD; PCB Footprint: 0603
R20 = RS93.1K-0.1W0603: as R7 on sheet 3. Buck Boost_19V; Lead Free: YES; Mounting: YES; RoHS Compliant: YES; Type: SMD; PCB Footprint: 0603
R21 = RS23.2K-0.1W0603: as R8 on sheet 3. Buck Boost_19V; Lead Free: YES; Mounting: YES; RoHS Compliant: YES; Type: SMD; PCB Footprint: 0603
R22 = RS10K-0.1W0603: as R9 on sheet 3. Buck Boost_19V; Lead Free: YES; Mounting: YES; RoHS Compliant: YES; Type: SMD; PCB Footprint: 0603; Help URL: https://www.digikey.com/product-detail/en/yageo/RC0603JR-0710KL/311-10KGRCT-ND/729647
R23 = RS20K-0.1W0603: as R10 on sheet 3. Buck Boost_19V; Lead Free: YES; Mounting: YES; RoHS Compliant: YES; Type: SMD; Help URL: *; PCB Footprint: 0603
R24 R26 = RS100R-0.1W0603: as R11 on sheet 3. Buck Boost_19V; Lead Free: YES; Mounting: YES; RoHS Compliant: YES; Type: SMD; PCB Footprint: 0603
R25 = RS18mR-1W1206: Manu Part Number: PRL1632-R018-F-T1; Manufacturer: Susumu; Vendor-1 Part Number: PRL1632.018FCT-ND; Vendor-1: DIGIKEY; Vendor-2: FARNELL; Lead Free: YES; Mounting: YES; RoHS Compliant: YES; Type: SMD
R31 = RS470R-1/10W0603: as R30 on sheet 3. Buck Boost_19V; Lead Free: YES; Mounting: YES; RoHS Compliant: YES; Type: SMD; PCB Footprint: 0603
TP8 TP9 = TP-1.5mmSMD: SMD TEST POINT
U2 = IC28P-LM5176PWPR: as U1 on sheet 3. Buck Boost_19V; Lead Free: YES; Mounting: YES; RoHS Compliant: YES; Type: SMD; Manufacturer Part Numbe: LM5176PWPR

## Sheet 5. Buck_5V1A.SchDoc
size A4; SheetNumber: 5; SheetTotal: 6
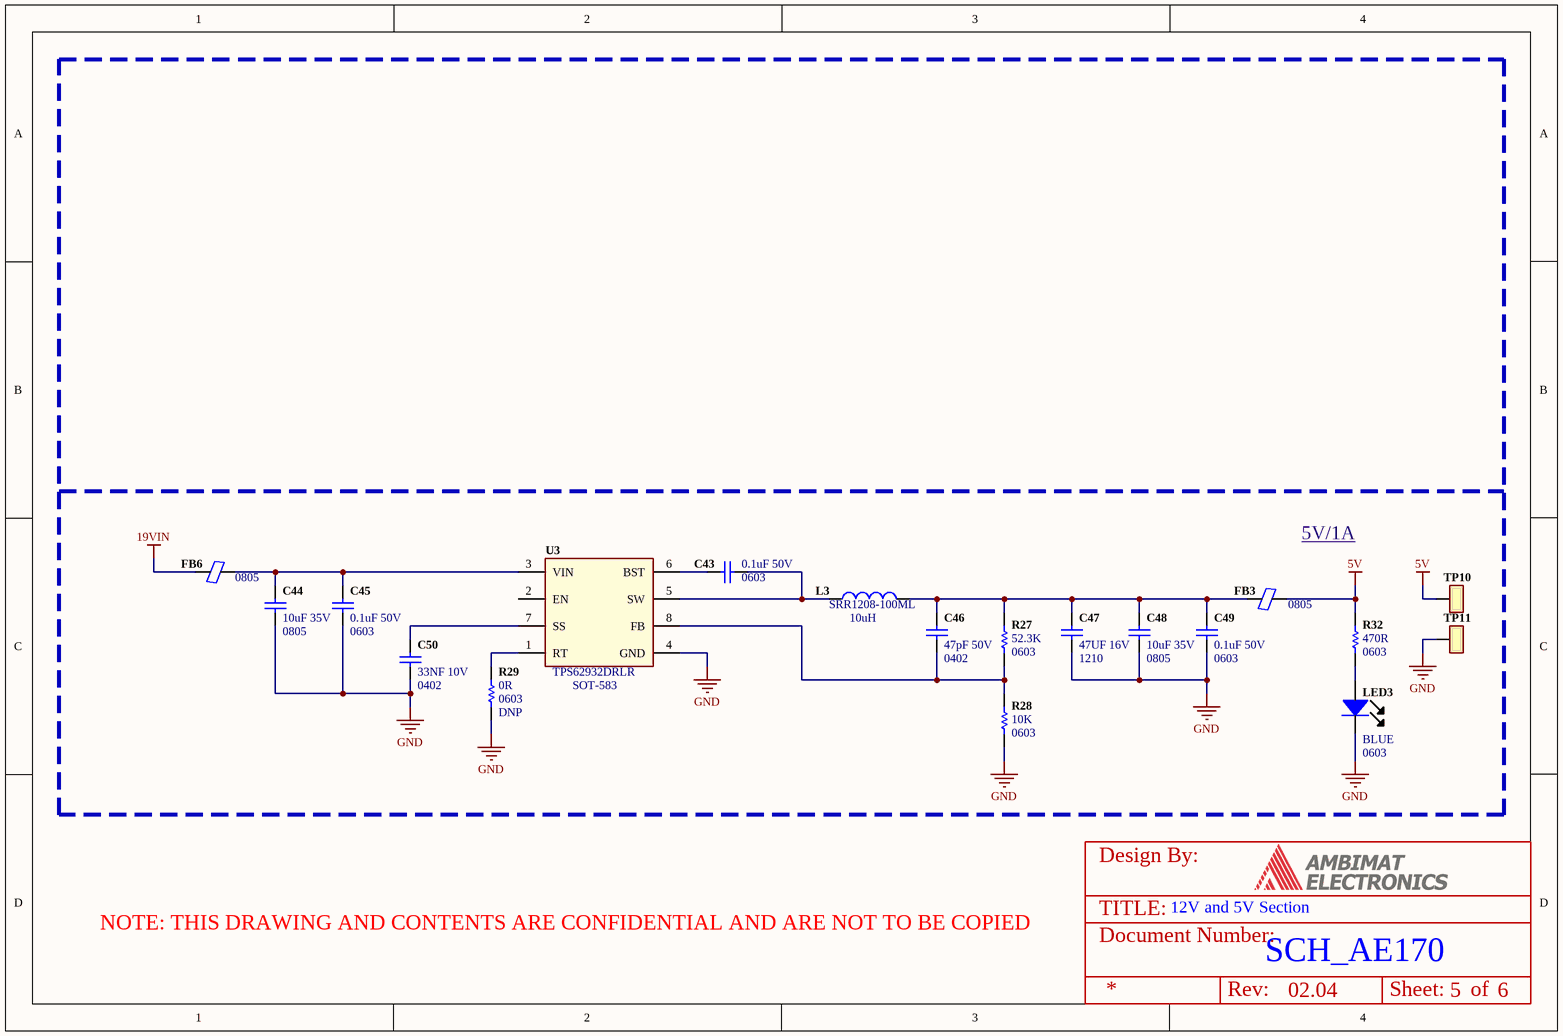
[diagram p4: 5. Buck_5V1A.SchDoc]

### Parts
C43  Part Name: 0.1uF 50V  PCB Footprint: 0603  [0603C]  (hidden comment: CAP CER 0.1UF 50V X7R 0603)
C44  Part Name: 10uF 35V  PCB Footprint: 0805  [0805C]  (hidden comment: CAP CER 10UF 35V X5R 0805)
C45  Part Name: 0.1uF 50V  PCB Footprint: 0603  [0603C]  (hidden comment: CAP CER 0.1UF 50V X7R 0603)
C46  Part Name: 47pF 50V  PCB Footprint: 0402  [0402C]  (hidden comment: CAP CER 47PF 50V C0G/NP0 0402)
C47  Part Name: 47UF 16V  PCB Footprint: 1210  [1210C]  (hidden comment: CAP CER 47UF 16V X5R 1210)
C48  Part Name: 10uF 35V  PCB Footprint: 0805  [0805C]  (hidden comment: CAP CER 10UF 35V X5R 0805)
C49  Part Name: 0.1uF 50V  PCB Footprint: 0603  [0603C]  (hidden comment: CAP CER 0.1UF 50V X7R 0603)
C50  Part Name: 33NF 10V  PCB Footprint: 0402  [0402C]  (hidden comment: CAP CER 0.033UF 10V X7R 0402)
FB3  PCB Footprint: 0805  [0805F]  (hidden comment: FERRITE BEAD 120 OHM 0805 1LN)
FB6  PCB Footprint: 0805  [0805F]  (hidden comment: FERRITE BEAD 120 OHM 0805 1LN)
L3  Manu Part Number: SRR1208-100ML  Part Name: 10uH  [IND_BOURNS_SRR1208]  (hidden comment: FIXED IND 10UH 5A 21 MOHM SMD)
LED3  PCB Footprint: 0603  Color: BLUE  [LED0603_BLUE]  (hidden comment: LB Q39G-L2N2-35-1)
R27  Part Name: 52.3K  [0603]  (hidden comment: RES 52.3K OHM 1% 1/10W 0603)
R28  Part Name: 10K  [0603]  (hidden comment: RES SMD 10K OHM 5% 1/10W 0603)
R29  Mounting: DNP  Part Name: 0R  [0603]  (hidden comment: RES SMD 0 OHM JUMPER 1/10W 0603)
R32  Part Name: 470R  [0603]  (hidden comment: RES 470 OHM 1/10W 5% 0603 SMD)
TP10  TEST POINT  [TP-1.5mmSMD]  (value not drawn)
TP11  TEST POINT  [TP-1.5mmSMD]  (value not drawn)
U3  PCB Footprint: SOT-583  Part Name: TPS62932DRLR  [SOT8_DRL_TEX]  (hidden comment: IC REG BUCK ADJ 2A SOT583)

### Blocks framed on the sheet
5V/1A: C43-C50 FB3 FB6 L3 LED3 R27-R29 R32 TP10 TP11 U3

### Nets
5V: FB3.2 R32.2 TP10.1
19VIN: FB6.1
GND: C44.2 C45.2 C47.1 C48.2 C49.2 C50.1 LED3.2(K) R28.1 R29.1 TP11.1 U3.4(GND)
NetC43_1: C43.1 U3.6(BST)
NetC43_2: C43.2 L3.1 U3.5(SW)
NetC44_1: C44.1 C45.1 FB6.2 U3.3(VIN)
NetC46_1: C46.1 C47.2 C48.1 C49.1 FB3.1 L3.2 R27.2
NetC46_2: C46.2 R27.1 R28.2 U3.8(FB)
NetC50_2: C50.2 U3.7(SS)
NetLED3_1: LED3.1(A) R32.1
NetR29_2: R29.2 U3.1(RT)

Not connected (* = marked no-connect by the designer): U3 2(EN)

### Notes on the sheet
- 12V and 5V Section
- SCH_AE170
- 02.04
- TITLE:
- Design By:
- NOTE: THIS DRAWING AND CONTENTS ARE CONFIDENTIAL AND ARE NOT TO BE COPIED
- Document Number:
- Rev:
- Sheet:
- of

### Library data of the parts
C43 C45 C49 = CS0.1uF-50V0603: as C1 on sheet 2. Input Section; Lead Free: YES; Mounting: YES; RoHS Compliant: YES
C44 C48 = CS10uF-35V0805: Manu Part Number: C2012X5R1V106K085AC; Manufacturer: TDK Corporation; Vendor-1 Part Number: 445-14417-1-ND; Type: SMD; Vendor-1: DIGIKEY; Vendor-2: FARNELL; Help URL: *; Lead Free: YES; Mounting: YES; RoHS Compliant: YES
C46 = CS47pF-50V0402: Manufacturer Part Number: CL05C470JB5NNNC; Manufacturer: Samsung Electro-Mechanics; Vendor-1 Part Number: 1276-1699-1-ND; Type: SMD; Vendor-1: DIGIKEY; Vendor-2: FARNELL; Lead Free: YES; Mounting: YES; RoHS Compliant: YES
C47 = CS47UF-16V1210: Manufacturer Part Number: GRM32ER61C476KE15L; Manufacturer: Murata Electronics; Vendor-1 Part Number: 490-6539-1-ND; Type: SMD; Vendor-1: DIGIKEY; Vendor-2: FARNELL; Lead Free: YES; Mounting: YES; RoHS Compliant: YES
C50 = CS33nF-10V0402: Manufacturer Part Number: GRM155R71A333KA01D; Manufacturer: Murata Electronics; Vendor-1 Part Number: 490-1315-1-ND; Type: SMD; Vendor-1: DIGIKEY; Vendor-2: FARNELL; Lead Free: YES; RoHS Compliant: YES; Mounting: YES
FB3 FB6 = FB120OHM-0805: as FB1 on sheet 3. Buck Boost_19V; Lead Free: YES; RoHS Compliant: YES; Vendor-2 Part Number: *; Vendor-2: *; Mounting: YES; Part Name: ABUP00201209121Y00
L3 = LS10uH 5A-12.7X12.7: Manufacturer: Bourns Inc.; Vendor-1 Part Number: SRR1208-100MLCT-ND; Vendor-1: Digikey; Vendor-2: MOUSER; Lead Free: YES; Mounting: YES; RoHS Compliant: YES; Type: SMD; PCB Footprint: 12.7 X 12.7
LED3 = LED-BLUE0603: as LED1 on sheet 3. Buck Boost_19V; Help URL: *; Lead Free: YES; Manu Part Number: LB Q39G-L2N2-35-1; Mounting: YES; RoHS Compliant: YES; Part Name: LB Q39G-L2N2-35-1
R27 = RS52.3K-0.1W0603: Manu Part Number: RC0603FR-0752K3L; Manufacturer: YAGEO; Vendor-1 Part Number: 311-52.3KHRCT-ND; Vendor-1: DIGIKEY; Vendor-2: FARNELL; Lead Free: YES; Mounting: YES; RoHS Compliant: YES; Type: SMD; PCB Footprint: 0603
R28 = RS10K-0.1W0603: as R6 on sheet 3. Buck Boost_19V; Lead Free: YES; Mounting: YES; Help URL: https://www.digikey.com/product-detail/en/yageo/RC0603JR-0710KL/311-10KGRCT-ND/729647; RoHS Compliant: YES; Type: SMD; PCB Footprint: 0603
R29 = RS0R-0.1W0603: Manufacturer: Vishay Dale; Vendor-1 Part Number: 541-2971-1-ND; Manu Part Number: CRCW06030000ZSTB; Vendor-1: DIGIKEY; Vendor-2: FARNELL; Lead Free: YES; RoHS Compliant: YES; Type: SMD; PCB Footprint: 0603
R32 = RS470R-1/10W0603: as R30 on sheet 3. Buck Boost_19V; Lead Free: YES; Mounting: YES; RoHS Compliant: YES; Type: SMD; PCB Footprint: 0603
TP10 TP11 = TP-1.5mmSMD: SMD TEST POINT
U3 = IC8P-TPS62932DRLR: Manufacturer: Texas Instruments; Vendor-1 Part Number: 296-TPS62932DRLRCT-ND; Vendor-1: DigiKey; Vendor-2: MOUSER; Lead Free: YES; Mounting: YES; RoHS Compliant: YES; Type: SMD; Manufacturer Part Number: TPS62932DRLR

## Sheet 6. Revision History.SchDoc
size A4; SheetNumber: 6; SheetTotal: 6; PageSetup: Record=PageOptions|CenterHorizontal=True|CenterVertical=True|PrintScale=1.00|XCorrection=1.00|YCorrection=1.00|PrintKind=0|BorderSize=5000000|LeftOffset=0|BottomOffset=0|Orientation=2|PaperLength=2970|PaperWidth=2100|Scale=100|PaperSource=7|PrintQuality=300|MediaType=1|DitherType=10|PrintScaleMode=1|PaperKind=A4|PaperIndex=9
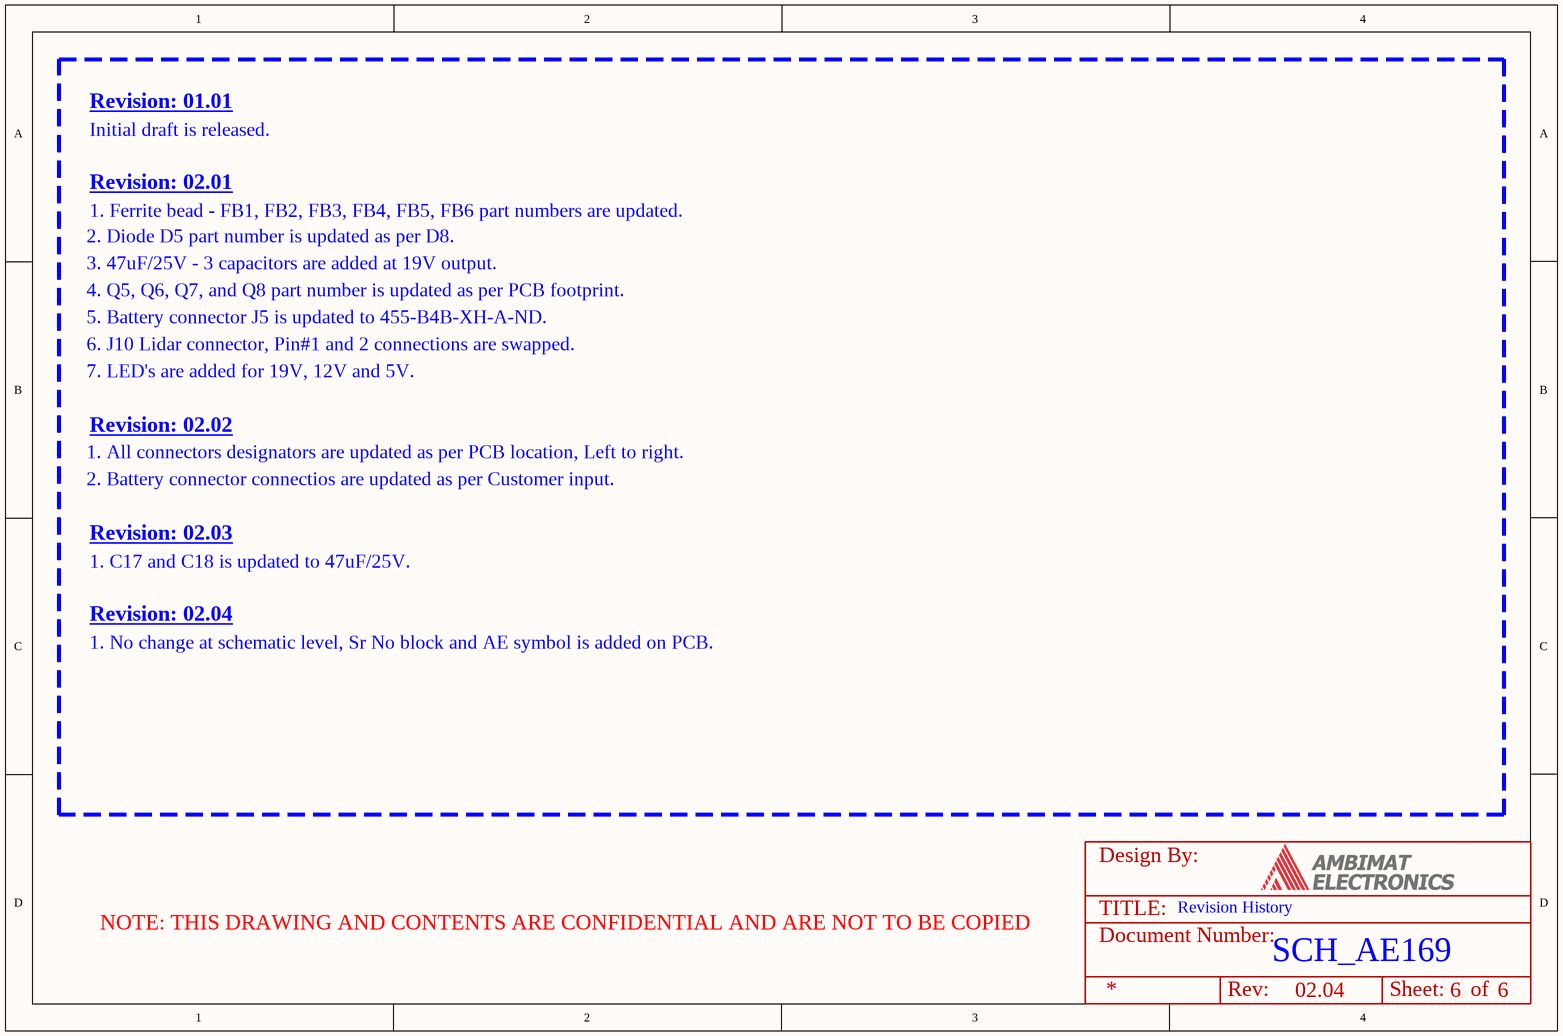
[diagram p5: 6. Revision History.SchDoc]

### Notes on the sheet
- Revision: 01.01
- Initial draft is released.
- 2. Diode D5 part number is updated as per D8.
- Revision: 02.01
- 1. Ferrite bead - FB1, FB2, FB3, FB4, FB5, FB6 part numbers are updated.
- 3. 47uF/25V - 3 capacitors are added at 19V output.
- 4. Q5, Q6, Q7, and Q8 part number is updated as per PCB footprint.
- 5. Battery connector J5 is updated to 455-B4B-XH-A-ND.
- 6. J10 Lidar connector, Pin#1 and 2 connections are swapped.
- 7. LED's are added for 19V, 12V and 5V.
- Revision: 02.02
- 1. All connectors designators are updated as per PCB location, Left to right.
- 2. Battery connector connectios are updated as per Customer input.
- Revision: 02.03
- 1. C17 and C18 is updated to 47uF/25V.
- Revision: 02.04
- 1. No change at schematic level, Sr No block and AE symbol is added on PCB.
- Revision History
- SCH_AE169
- 02.04
- TITLE:
- Design By:
- NOTE: THIS DRAWING AND CONTENTS ARE CONFIDENTIAL AND ARE NOT TO BE COPIED
- Document Number:
- Rev:
- Sheet:
- of

## Nets that join several sheets
5V: 2. Input Section (J3.1 J4.1), 5. Buck_5V1A (FB3.2 R32.2 TP10.1)
12V: 2. Input Section (J1.1 J2.2 J5.1 J6.1), 4. Buck Boost_12V (FB2.2 R31.2 TP8.1)
19V: 2. Input Section (C1.2 J7.1), 3. Buck Boost_19V (FB1.1 R30.2 TP6.1)
19VIN: 2. Input Section (C5.1 SW2.1 TP1.1), 3. Buck Boost_19V (FB4.1), 4. Buck Boost_12V (FB5.1), 5. Buck_5V1A (FB6.1)
GND: 2. Input Section (28 pins), 3. Buck Boost_19V (31 pins), 4. Buck Boost_12V (28 pins), 5. Buck_5V1A (11 pins)